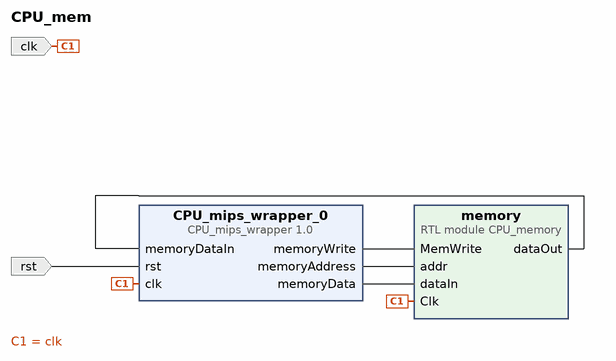
[diagram p0: block diagram of the top level]
# Vivado block design CPU_mem, xc7z020clg400-1, Vivado 2018.3
create_bd_design CPU_mem

create_bd_port -dir I -type clk clk
create_bd_port -dir I -type rst rst

create_bd_cell -type ip -vlnv xilinx.com:user:CPU_mips_wrapper:1.0 CPU_mips_wrapper_0
create_bd_cell -type module -reference CPU_memory memory

# ---- connections ----

connect_bd_net -net clk_0_1 [get_bd_ports clk] [get_bd_pins CPU_mips_wrapper_0/clk] [get_bd_pins memory/Clk]
connect_bd_net [get_bd_ports rst] [get_bd_pins CPU_mips_wrapper_0/rst]
connect_bd_net [get_bd_pins CPU_mips_wrapper_0/memoryWrite] [get_bd_pins memory/MemWrite]
connect_bd_net [get_bd_pins CPU_mips_wrapper_0/memoryAddress] [get_bd_pins memory/addr]
connect_bd_net [get_bd_pins CPU_mips_wrapper_0/memoryData] [get_bd_pins memory/dataIn]
connect_bd_net -net CPU_memory_0_dataOut [get_bd_pins memory/dataOut] [get_bd_pins CPU_mips_wrapper_0/memoryDataIn]

validate_bd_design
save_bd_design
